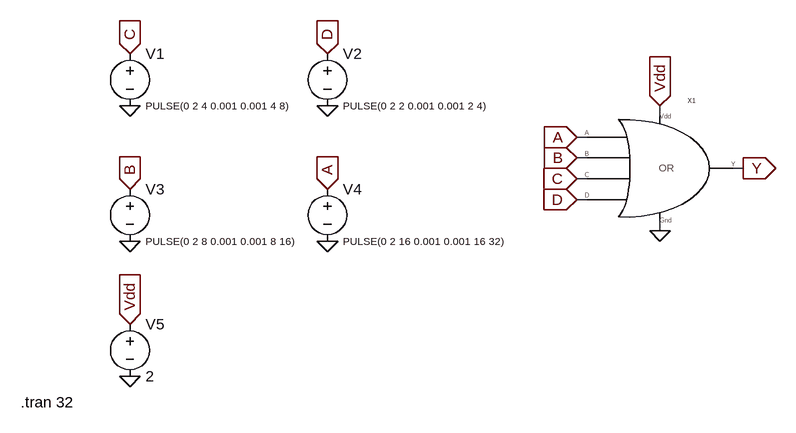
[diagram p0: schematic 4OR symbol.asc]
4OR symbol.asc, the LTspice schematic file:
Version 4
SHEET 1 880 680
WIRE 624 48 624 32
WIRE 512 80 496 80
WIRE 512 112 496 112
WIRE 752 128 736 128
WIRE 512 144 496 144
WIRE 512 176 496 176
WIRE 624 224 624 208
FLAG -192 368 Vdd
IOPIN -192 368 In
FLAG 112 -48 D
IOPIN 112 -48 In
FLAG -192 -48 C
IOPIN -192 -48 In
FLAG -192 160 B
IOPIN -192 160 In
FLAG -192 448 0
FLAG 112 240 0
FLAG -192 240 0
FLAG -192 32 0
FLAG 112 32 0
FLAG 112 160 A
IOPIN 112 160 In
FLAG 496 80 A
IOPIN 496 80 In
FLAG 496 112 B
IOPIN 496 112 In
FLAG 496 144 C
IOPIN 496 144 In
FLAG 496 176 D
IOPIN 496 176 In
FLAG 624 32 Vdd
IOPIN 624 32 In
FLAG 624 224 0
FLAG 752 128 Y
IOPIN 752 128 Out
SYMBOL voltage -192 -64 R0
WINDOW 3 24 96 Left 1
WINDOW 123 0 0 Left 0
WINDOW 39 0 0 Left 0
SYMATTR Value PULSE(0 2 4 0.001 0.001 4 8)
SYMATTR InstName V1
SYMBOL voltage 112 -64 R0
WINDOW 3 24 96 Left 1
WINDOW 123 0 0 Left 0
WINDOW 39 0 0 Left 0
SYMATTR Value PULSE(0 2 2 0.001 0.001 2 4)
SYMATTR InstName V2
SYMBOL voltage -192 144 R0
WINDOW 3 24 96 Left 1
WINDOW 123 0 0 Left 0
WINDOW 39 0 0 Left 0
SYMATTR Value PULSE(0 2 8 0.001 0.001 8 16)
SYMATTR InstName V3
SYMBOL voltage 112 144 R0
WINDOW 3 24 96 Left 1
WINDOW 123 0 0 Left 0
WINDOW 39 0 0 Left 0
SYMATTR Value PULSE(0 2 16 0.001 0.001 16 32)
SYMATTR InstName V4
SYMBOL voltage -192 352 R0
WINDOW 123 0 0 Left 0
WINDOW 39 0 0 Left 0
SYMATTR InstName V5
SYMATTR Value 2
SYMBOL 4or 544 96 R0
SYMATTR InstName X1
TEXT -360 488 Left 2 !.tran 32

The netlist it stands for:
* 4OR symbol.asc
V1 C 0 PULSE(0 2 4 0.001 0.001 4 8)
V2 D 0 PULSE(0 2 2 0.001 0.001 2 4)
V3 B 0 PULSE(0 2 8 0.001 0.001 8 16)
V4 A 0 PULSE(0 2 16 0.001 0.001 16 32)
V5 Vdd 0 2
XX1 Vdd 0 A B C D Y 4or  ; pins Vdd Gnd A B C D Y
.tran 32
.backanno
.end

* Results of the author's LTspice run, read from the files saved beside the schematic
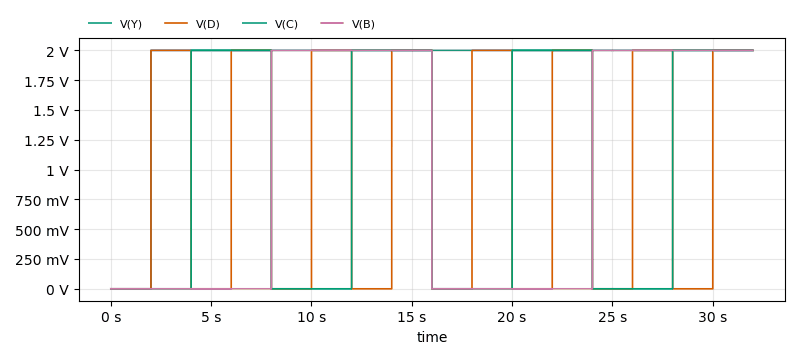
[diagram p1: Transient Analysis of 4OR symbol.asc, plotted from the saved traces]
* Transient Analysis, 1 run:
*   V(Y): min 401 nV, max 2 V, average 1.875 V, rms 1.936 V, last 2 V
*   V(D): min 0 V, max 2 V, average 1 V, rms 1.414 V, last 2 V
*   V(C): min 0 V, max 2 V, average 1 V, rms 1.414 V, last 2 V
*   V(B): min 0 V, max 2 V, average 1 V, rms 1.414 V, last 2 V